# EAGLE design 1_Main (EAGLE 7.6.0)
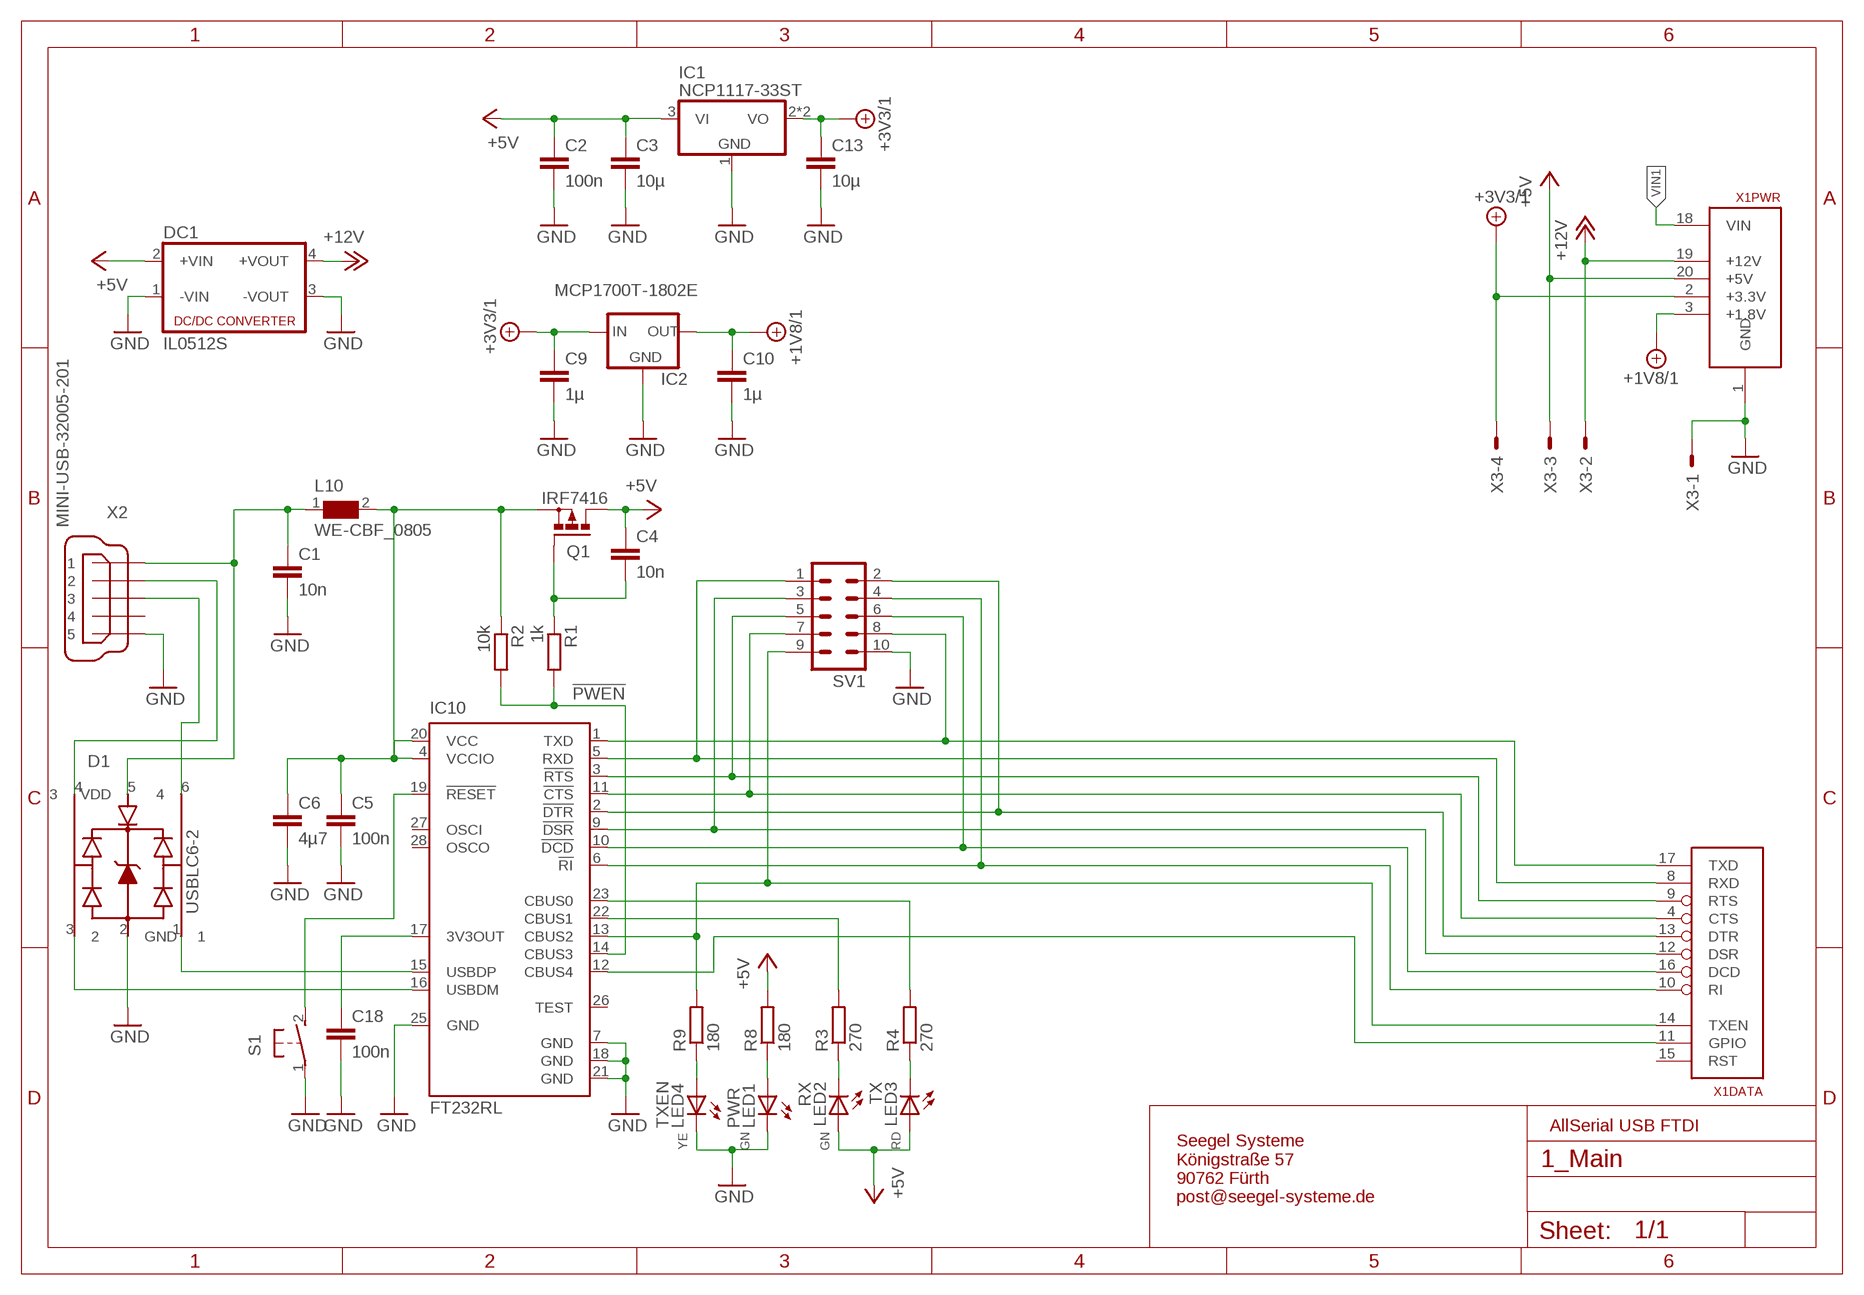
[diagram p0: schematic, sheet 1]

## Parts
C1  10n  C-EUC0805  [C0805]
C2  100n  C-EUC0805  [C0805]
C3  10µ  C-EUC0805  [C0805]
C4  10n  C-EUC0805  [C0805]
C5  100n  C-EUC0805  [C0805]
C6  4µ7  C-EUC0805  [C0805]
C9  1µ  C-EUC0805  [C0805]
C10  1µ  C-EUC0805  [C0805]
C13  10µ  C-EUC0805  [C0805]
C18  100n  C-EUC0805  [C0805]
D1  USBLC6-2  WE-TVS_82400102  [WE-TVS_SOT23-6L]
DC1  IL0512S  NME  [NME]
IC1  NCP1117-33ST  [SOT223]
IC2  MCP1700T-1802E  MCP170X  [SOT23]
IC10  FT232RL  [SSOP28]
L10  WE-CBF_0805  [0805]
LED1  PWR  LEDCHIPLED_0603  [CHIPLED_0603]
LED2  RX  LEDCHIPLED_0603  [CHIPLED_0603]
LED3  TX  LEDCHIPLED_0603  [CHIPLED_0603]
LED4  TXEN  LEDCHIPLED_0603  [CHIPLED_0603]
Q1  IRF7416  P-MOSFET-SO8  [SO-08]
R1  1k  R-EU_R0805  [R0805]
R2  10k  R-EU_R0805  [R0805]
R3  270  R-EU_R0805  [R0805]
R4  270  R-EU_R0805  [R0805]
R8  180  R-EU_R0805  [R0805]
R9  180  R-EU_R0805  [R0805]
S1  31-XX  [B3F-31XX]
SV1  ML10  [ML10]
X1  ALLSERIALMASTERMM  [MAIN-THT]
X2  MINI-USB-32005-201  [32005-201]
X3  AKL18X-04W  [AKL182-04]

## Nets
!PWEN: IC10.14(CBUS3) R1.2 R2.2
+1V8/1: C10.1 IC2.2(OUT) X1.3(PWR:+1.8V)
+3V3/1: C9.1 C13.1 IC1.2(VO) IC1.4(VO) IC2.3(IN) X1.2(PWR:+3.3V) X3.P$4
+5V: C2.1 C3.1 C4.1 DC1.2(+VIN) IC1.3(VI) LED2.A LED3.A Q1.5(D) Q1.6(D) Q1.7(D) Q1.8(D) R8.2 X1.20(PWR:+5V) X3.P$3
+12V: DC1.4(+VOUT) X1.19(PWR:+12V) X3.P$2
GND: C1.2 C2.2 C3.2 C5.2 C6.2 C9.2 C10.2 C13.2 C18.2 D1.2(GND) DC1.1(-VIN) DC1.3(-VOUT) IC1.1(GND) IC2.1(GND) IC10.7(GND) IC10.18(GND) IC10.21(GND) IC10.25(GND) LED1.C LED4.C S1.1(P) SV1.10 X1.1(PWR:GND) X2.5 X3.P$1
N$1: IC10.5(RXD) SV1.1 X1.8(DATA:RXD)
N$2: IC10.9(!DSR) SV1.3 X1.12(DATA:DSR)
N$3: IC10.13(CBUS2) R9.2 SV1.9 X1.14(DATA:TXEN)
N$4: LED3.C R4.1
N$5: IC10.19(!RESET) S1.2(S)
N$6: LED2.C R3.1
N$7: LED4.A R9.1
N$8: LED1.A R8.1
N$9: D1.3 IC10.16(USBDM)
N$10: D1.1 IC10.15(USBDP)
N$11: C1.1 D1.5(VDD) L10.1 X2.1
N$12: D1.4 X2.2
N$13: IC10.12(CBUS4) X1.11(DATA:GPIO)
N$14: IC10.1(TXD) SV1.8 X1.17(DATA:TXD)
N$15: D1.6 X2.3
N$22: C18.1 IC10.17(3V3OUT)
N$29: IC10.3(!RTS) SV1.5 X1.9(DATA:RTS)
N$32: IC10.11(!CTS) SV1.7 X1.4(DATA:CTS)
N$33: IC10.2(!DTR) SV1.2 X1.13(DATA:DTR)
N$35: IC10.10(!DCD) SV1.6 X1.16(DATA:DCD)
N$36: IC10.6(!RI) SV1.4 X1.10(DATA:RI)
N$38: C5.1 C6.1 IC10.4(VCCIO) IC10.20(VCC) L10.2 Q1.1(S) Q1.2(S) Q1.3(S) R2.1
N$42: C4.2 Q1.4(G) R1.1
RXLED: IC10.22(CBUS1) R3.2
TXLED: IC10.23(CBUS0) R4.2
VIN1: X1.18(PWR:VIN)
Unconnected: IC10.26(TEST) IC10.27(OSCI) IC10.28(OSCO) X1.5(USB:D-) X1.6(USB:D+) X1.7(USB:VUSB) X1.15(DATA:RST) X2.4

## Notes on the sheet
- AllSerial USB FTDI
- Seegel Systeme
  Königstraße 57
  90762 Fürth
  post@seegel-systeme.de

## Library data of the parts
C1-C6 C9 C10 C13 C18 = rcl:C-EU: CAPACITOR, European symbol
D1 = EagleLibrary_Wuerth_Elektronik_eiSos_Version_6-9:WE-TVS_82400102: TVS Diode Array WE-TVS, High Speed Series - Low capazity - No leakage current - Low clamping voltage - high ESD voltage protection -- USB 1.0 - 2.0 Flow Thru Design
DC1 = dc-dc-converter:NME: DC-DC CONVERTER; MF: C & D TECHNOLOGIES, INC; MPN: NME1205D; OC_FARNELL: 1021466; OC_NEWARK: 98B8198
IC1 = linear:NCP1117
IC2 = SeeSys:MCP170X
IC10 = ftdichip:FT232R: Source: http://www.ftdichip.com/Documents/DataSheets/DS_FT232R_v104.pdf; MPN: FT232RL; OC_FARNELL: 1146032; OC_NEWARK: 91K9918
L10 = EagleLibrary_Wuerth_Elektronik_eiSos_Version_6-12:WE-CBF: SMD EMI Suppression Ferrite Beads WE-CBF - Excellent anti-EMI properties - Low DC-restistance - Impedances till 3000 ohms - Rated current up to 6 A -- Reliable Ni-Sn electrodes -- Perfect as data lined filter and for uncoupling of distribution voltage
LED1 LED2 = led:LED: LED OSRAM: - CHIPLED LG R971, LG N971, LY N971, LG Q971, LY Q971, LO R971, LY R971 LH N974, LH R974 LS Q976, LO Q976, LY Q976 LO Q996 - Hyper CHIPLED LW Q18S LB Q993, LB Q99A, LB R99A - SideLED LS A670, LO A670, LY A670, LG A670, LP A670 LB A673, LV A673, LT A673, LW A673 LH A674 LY A675 LS A676, LA A676, LO A676, LY A676, LW A676 LS A679, LY A679, LG A679 - Hyper Micro SIDELED® LS Y876, LA Y876, LO Y876, LY Y876 LT Y87S - SmartLED LW L88C, LW L88S LB L89C, LB L89S, LG L890 LS L89K, LO L89K, LY L89K LS L896, LA L896, LO L896, LY L896 - TOPLED LS T670, LO T670, LY T670, LG T670, LP T670 LSG T670, LSP T670, LSY T670, LOP T670, LYG T670 LG T671, LOG T671, LSG T671 LB T673, LV T673, LT T673, LW T673 LH T674 LS T676, LA T676, LO T676, LY T676, LB T676, LH T676, LSB T676, LW T676 LB T67C, LV T67C, LT T67C, LS T67K, LO T67K, LY T67K, LW E67C LS E67B, LA E67B, LO E67B, LY E67B, LB E67C, LV E67C, LT E67C LW T67C LS T679, LY T679, LG T679 LS T770, LO T770, LY T770, LG T770, LP T770 LB T773, LV T773, LT T773, LW T773 LH T774 LS E675, LA E675, LY E675, LS T675 LS T776, LA T776, LO T776, LY T776, LB T776 LHGB T686 LT T68C, LB T68C - Hyper Mini TOPLED® LB M676 - Mini TOPLED Santana® LG M470 LS M47K, LO M47K, LY M47K Source: http://www.osram.convergy.de LUXEON: - LUMILED® LXK2-PW12-R00, LXK2-PW12-S00, LXK2-PW14-U00, LXK2-PW14-V00 LXK2-PM12-R00, LXK2-PM12-S00, LXK2-PM14-U00 LXK2-PE12-Q00, LXK2-PE12-R00, LXK2-PE12-S00, LXK2-PE14-T00, LXK2-PE14-U00 LXK2-PB12-K00, LXK2-PB12-L00, LXK2-PB12-M00, LXK2-PB14-N00, LXK2-PB14-P00, LXK2-PB14-Q00 LXK2-PR12-L00, LXK2-PR12-M00, LXK2-PR14-Q00, LXK2-PR14-R00 LXK2-PD12-Q00, LXK2-PD12-R00, LXK2-PD12-S00 LXK2-PH12-R00, LXK2-PH12-S00 LXK2-PL12-P00, LXK2-PL12-Q00, LXK2-PL12-R00 Source: www.luxeon.com KINGBRIGHT: KA-3528ASYC Source: www.kingbright.com; COLOR: GN
LED3 = led:LED: LED OSRAM: - CHIPLED LG R971, LG N971, LY N971, LG Q971, LY Q971, LO R971, LY R971 LH N974, LH R974 LS Q976, LO Q976, LY Q976 LO Q996 - Hyper CHIPLED LW Q18S LB Q993, LB Q99A, LB R99A - SideLED LS A670, LO A670, LY A670, LG A670, LP A670 LB A673, LV A673, LT A673, LW A673 LH A674 LY A675 LS A676, LA A676, LO A676, LY A676, LW A676 LS A679, LY A679, LG A679 - Hyper Micro SIDELED® LS Y876, LA Y876, LO Y876, LY Y876 LT Y87S - SmartLED LW L88C, LW L88S LB L89C, LB L89S, LG L890 LS L89K, LO L89K, LY L89K LS L896, LA L896, LO L896, LY L896 - TOPLED LS T670, LO T670, LY T670, LG T670, LP T670 LSG T670, LSP T670, LSY T670, LOP T670, LYG T670 LG T671, LOG T671, LSG T671 LB T673, LV T673, LT T673, LW T673 LH T674 LS T676, LA T676, LO T676, LY T676, LB T676, LH T676, LSB T676, LW T676 LB T67C, LV T67C, LT T67C, LS T67K, LO T67K, LY T67K, LW E67C LS E67B, LA E67B, LO E67B, LY E67B, LB E67C, LV E67C, LT E67C LW T67C LS T679, LY T679, LG T679 LS T770, LO T770, LY T770, LG T770, LP T770 LB T773, LV T773, LT T773, LW T773 LH T774 LS E675, LA E675, LY E675, LS T675 LS T776, LA T776, LO T776, LY T776, LB T776 LHGB T686 LT T68C, LB T68C - Hyper Mini TOPLED® LB M676 - Mini TOPLED Santana® LG M470 LS M47K, LO M47K, LY M47K Source: http://www.osram.convergy.de LUXEON: - LUMILED® LXK2-PW12-R00, LXK2-PW12-S00, LXK2-PW14-U00, LXK2-PW14-V00 LXK2-PM12-R00, LXK2-PM12-S00, LXK2-PM14-U00 LXK2-PE12-Q00, LXK2-PE12-R00, LXK2-PE12-S00, LXK2-PE14-T00, LXK2-PE14-U00 LXK2-PB12-K00, LXK2-PB12-L00, LXK2-PB12-M00, LXK2-PB14-N00, LXK2-PB14-P00, LXK2-PB14-Q00 LXK2-PR12-L00, LXK2-PR12-M00, LXK2-PR14-Q00, LXK2-PR14-R00 LXK2-PD12-Q00, LXK2-PD12-R00, LXK2-PD12-S00 LXK2-PH12-R00, LXK2-PH12-S00 LXK2-PL12-P00, LXK2-PL12-Q00, LXK2-PL12-R00 Source: www.luxeon.com KINGBRIGHT: KA-3528ASYC Source: www.kingbright.com; COLOR: RD
LED4 = led:LED: LED OSRAM: - CHIPLED LG R971, LG N971, LY N971, LG Q971, LY Q971, LO R971, LY R971 LH N974, LH R974 LS Q976, LO Q976, LY Q976 LO Q996 - Hyper CHIPLED LW Q18S LB Q993, LB Q99A, LB R99A - SideLED LS A670, LO A670, LY A670, LG A670, LP A670 LB A673, LV A673, LT A673, LW A673 LH A674 LY A675 LS A676, LA A676, LO A676, LY A676, LW A676 LS A679, LY A679, LG A679 - Hyper Micro SIDELED® LS Y876, LA Y876, LO Y876, LY Y876 LT Y87S - SmartLED LW L88C, LW L88S LB L89C, LB L89S, LG L890 LS L89K, LO L89K, LY L89K LS L896, LA L896, LO L896, LY L896 - TOPLED LS T670, LO T670, LY T670, LG T670, LP T670 LSG T670, LSP T670, LSY T670, LOP T670, LYG T670 LG T671, LOG T671, LSG T671 LB T673, LV T673, LT T673, LW T673 LH T674 LS T676, LA T676, LO T676, LY T676, LB T676, LH T676, LSB T676, LW T676 LB T67C, LV T67C, LT T67C, LS T67K, LO T67K, LY T67K, LW E67C LS E67B, LA E67B, LO E67B, LY E67B, LB E67C, LV E67C, LT E67C LW T67C LS T679, LY T679, LG T679 LS T770, LO T770, LY T770, LG T770, LP T770 LB T773, LV T773, LT T773, LW T773 LH T774 LS E675, LA E675, LY E675, LS T675 LS T776, LA T776, LO T776, LY T776, LB T776 LHGB T686 LT T68C, LB T68C - Hyper Mini TOPLED® LB M676 - Mini TOPLED Santana® LG M470 LS M47K, LO M47K, LY M47K Source: http://www.osram.convergy.de LUXEON: - LUMILED® LXK2-PW12-R00, LXK2-PW12-S00, LXK2-PW14-U00, LXK2-PW14-V00 LXK2-PM12-R00, LXK2-PM12-S00, LXK2-PM14-U00 LXK2-PE12-Q00, LXK2-PE12-R00, LXK2-PE12-S00, LXK2-PE14-T00, LXK2-PE14-U00 LXK2-PB12-K00, LXK2-PB12-L00, LXK2-PB12-M00, LXK2-PB14-N00, LXK2-PB14-P00, LXK2-PB14-Q00 LXK2-PR12-L00, LXK2-PR12-M00, LXK2-PR14-Q00, LXK2-PR14-R00 LXK2-PD12-Q00, LXK2-PD12-R00, LXK2-PD12-S00 LXK2-PH12-R00, LXK2-PH12-S00 LXK2-PL12-P00, LXK2-PL12-Q00, LXK2-PL12-R00 Source: www.luxeon.com KINGBRIGHT: KA-3528ASYC Source: www.kingbright.com; COLOR: YE
Q1 = transistor-power:P-MOSFET-SO8: P-Channel MOSFET Example: FDS4435A; P-Channel Logic Level PowerTrench® MOSFET FDS4465; P-Channel 1.8V Specified PowerTrench® MOSFET Source: www.fairchildsemi.com
R1-R4 R8 R9 = rcl:R-EU_: RESISTOR, European symbol
S1 = switch-omron:31-XX: OMRON SWITCH; MPN: B3F-3100; OC_FARNELL: 959704; OC_NEWARK: 36M3582
SV1 = con-harting-ml:ML10: HARTING; OC_FARNELL: unknown; OC_NEWARK: unknown
X1 = AllSerialv2:ALLSERIALMASTER
X2 = con-cypressindustries:MINI-USB-: MINI USB-B Conector Source: www.cypressindustries.com; OC_FARNELL: unknown; OC_NEWARK: unknown
X3 = con-riacon_akl:AKL18X-04: Riacon AKL18X Steckverbinder 4-Pol Grid = 3,5mm

## Board
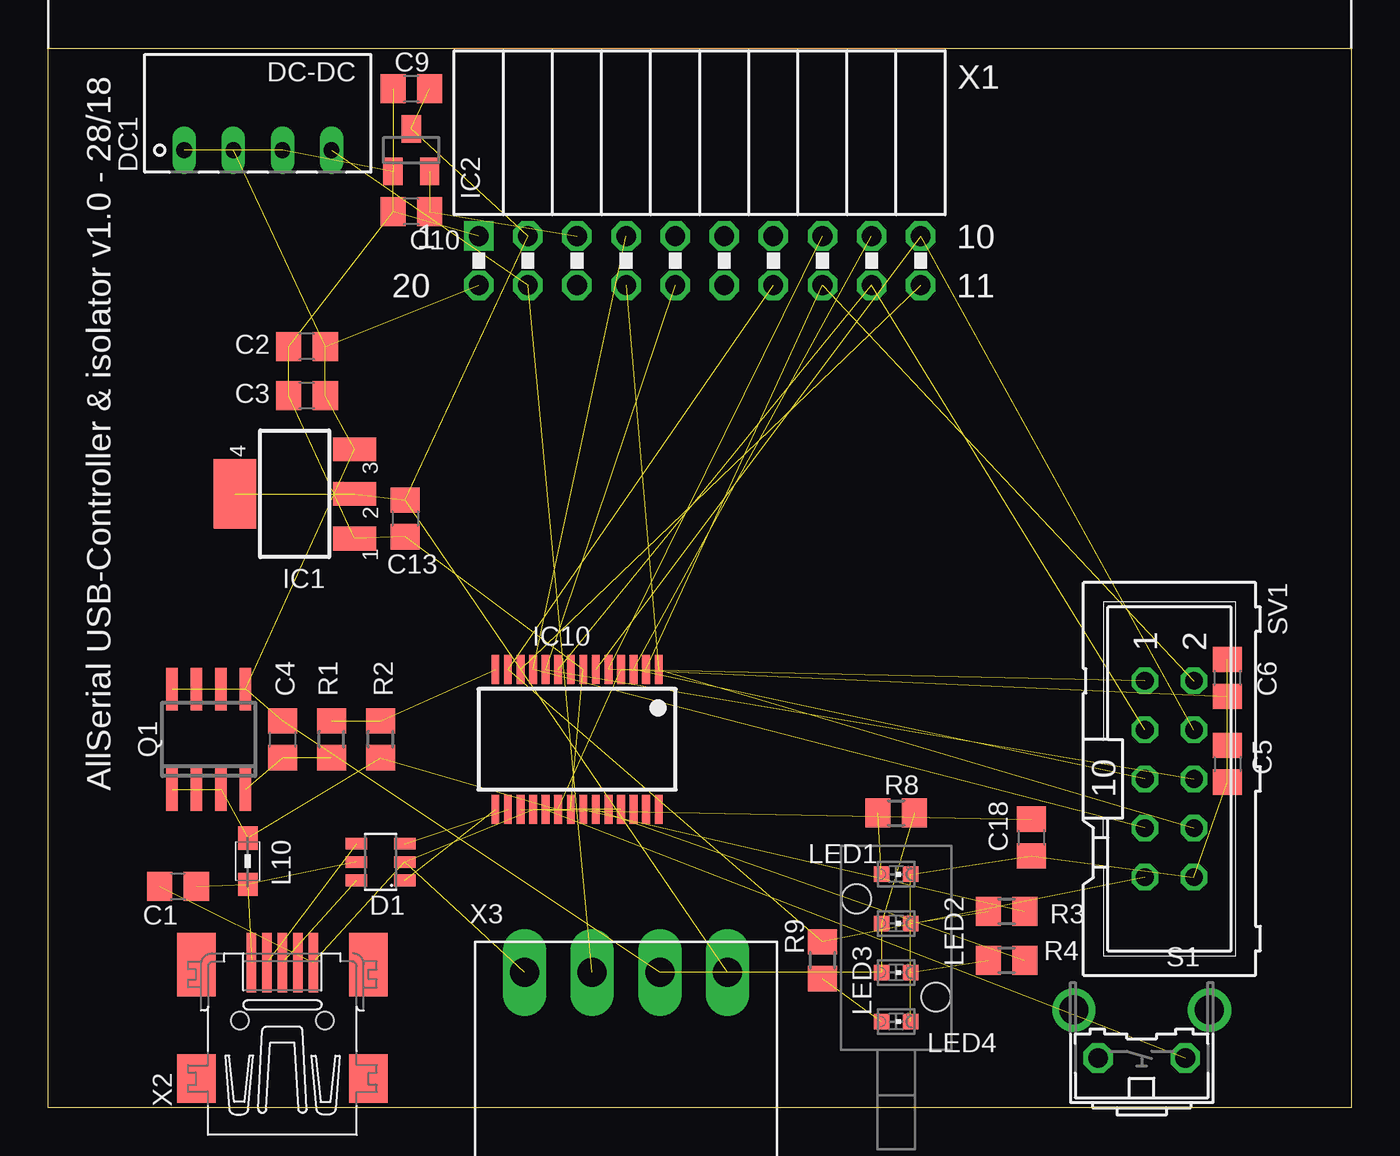
[diagram p1: board, top side]
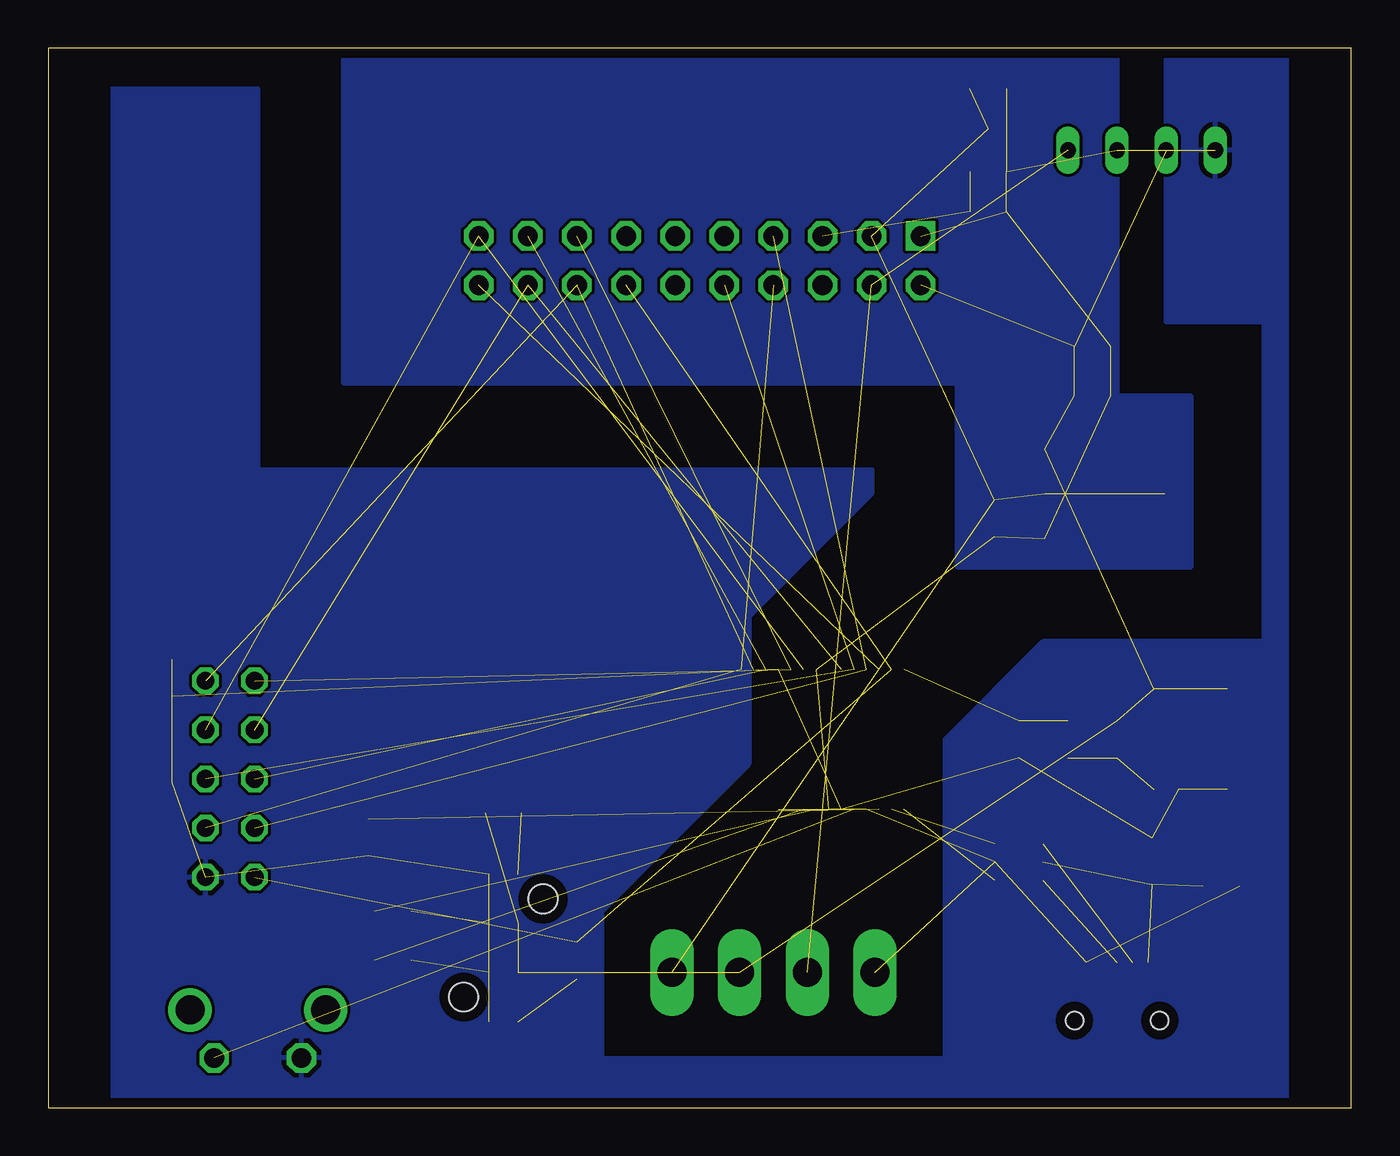
[diagram p2: board, bottom side, seen from below]

Size 67.4 x 54.8 mm. Coordinates in mm from the lower left corner, seen from the top.
Copper layers (1*16): Top 0.035mm / dielectric 1.6mm / Bottom 0.035mm
Design rules "Elecrow_2-layer_PCB_eagle_rule *": minimum track width 6mil, minimum drill 0.3mm, track to track 6mil, track to pad 6mil, pad to pad 6mil, via to via 8mil, smd to smd 0mil, copper to edge 20mil, drill to drill 10mil, minimum pad ring 6mil, minimum via ring 6mil, stop-mask expansion 0mil, vias tented up to drill 100mil, thermal gap 10mil

### Footprints (pad centres in the part's own frame; a part is rotated, then mirrored left to right if it is on the bottom)
C0805 = smd 1.3 x 1.5: 1 -0.95,0; 2 0.95,0
WE-TVS_SOT23-6L = smd 0.6 x 1.1: 1 -0.95,-1.25; 2 0,-1.25; 3 0.95,-1.25; 4 0.95,1.25; 5 0,1.25; 6 -0.95,1.25
NME = drill 0.813 long: 1 0,3.81; 2 0,1.27; 3 0,-1.27; 4 0,-3.81
SOT223 = smd 1.219 x 2.235: 1 -2.311,-3.099; 2 0,-3.099; 3 2.311,-3.099 | smd 3.6 x 2.2: 4 0,3.099
SOT23 = smd 1 x 1.4: 1 -0.95,-1.1; 2 0.95,-1.1; 3 0,1.1
SSOP28 = smd 0.4 x 1.5: 1 -4.225,-3.625; 2 -3.575,-3.625; 3 -2.925,-3.625; 4 -2.275,-3.625; 5 -1.625,-3.625; 6 -0.975,-3.625; 7 -0.325,-3.625; 8 0.325,-3.625; 9 0.975,-3.625; 10 1.625,-3.625; 11 2.275,-3.625; 12 2.925,-3.625; 13 3.575,-3.625; 14 4.225,-3.625; 15 4.225,3.625; 16 3.575,3.625; 17 2.925,3.625; 18 2.275,3.625; 19 1.625,3.625; 20 0.975,3.625; 21 0.325,3.625; 22 -0.325,3.625; 23 -0.975,3.625; 24 -1.625,3.625; 25 -2.275,3.625; 26 -2.925,3.625; 27 -3.575,3.625; 28 -4.225,3.625
0805 = smd 1.2 x 1: 1 -1.2,0; 2 1.2,0
CHIPLED_0603 = smd 0.8 x 0.8: A 0,-0.75; C 0,0.75
SO-08 = smd 0.6 x 2.2: 1 -1.905,-2.6; 2 -0.635,-2.6; 3 0.635,-2.6; 4 1.905,-2.6; 5 1.905,2.6; 6 0.635,2.6; 7 -0.635,2.6; 8 -1.905,2.6
R0805 = smd 1.3 x 1.5: 1 -0.95,0; 2 0.95,0
B3F-31XX = drill 1.016 octagon: 1 -2.261,-1.245; 2 2.261,-1.245 | drill 1.499 pad 2.159: 3 -3.505,1.245; 4 3.505,1.245
ML10 = drill 0.914 octagon: 1 -5.08,-1.27; 2 -5.08,1.27; 3 -2.54,-1.27; 4 -2.54,1.27; 5 0,-1.27; 6 0,1.27; 7 2.54,-1.27; 8 2.54,1.27; 9 5.08,-1.27; 10 5.08,1.27
1296.1004 = hole 1.5: 2.05,-2.54; -2.05,2.54
MAIN-THT = drill 1.016 square: 1 -11.43,45.085 | drill 1.016 octagon: 2 -8.89,45.085; 3 -6.35,45.085; 4 -3.81,45.085; 5 -1.27,45.085; 6 1.27,45.085; 7 3.81,45.085; 8 6.35,45.085; 9 8.89,45.085; 10 11.43,45.085; 11 11.43,42.545; 12 8.89,42.545; 13 6.35,42.545; 14 3.81,42.545; 15 1.27,42.545; 16 -1.27,42.545; 17 -3.81,42.545; 18 -6.35,42.545; 19 -8.89,42.545; 20 -11.43,42.545
32005-201 = smd 3.1 x 0.5: 1 3,1.6; 2 3,0.8; 3 3,0; 4 3,-0.8; 5 3,-1.6 | smd 2.5 x 2: M1 -3,-4.45; M2 -3,4.45 | smd 3.3 x 2: M3 2.9,4.45; M4 2.9,-4.45 | hole 0.9: 0,2.2; 0,-2.2
AKL182-04 = drill 1.5 pad 2.184 long: P$1 -5.25,0; P$2 -1.75,0; P$3 1.75,0; P$4 5.25,0

### Placement (x,y rotation side)
C1  6.71,11.43 180 top
C2  13.38,39.37 180 top
C3  13.38,36.83 180 top
C4  12.11,19.05 270 top
C5  61.01,17.78 270 top
C6  61.01,22.23 90 top
C9  18.78,52.7 180 top
C10  18.78,46.35 180 top
C13  18.46,30.48 270 top
C18  50.84,13.97 270 top
D1  17.19,12.7 90 top
DC1  10.84,49.53 90 top
IC1  12.75,31.75 90 top
IC2  18.78,49.53 0 top
IC10  27.35,19.05 180 top
L10  10.32,12.74 90 top
LED1  43.86,12.06 270 top
LED2  43.86,9.53 270 top
LED3  43.86,6.99 270 top
LED4  43.86,4.45 270 top
Q1  8.3,19.05 0 top
R1  14.65,19.05 90 top
R2  17.19,19.05 90 top
R3  49.58,10.16 0 top
R4  49.58,7.62 0 top
R8  43.86,15.24 0 top
R9  40.05,7.62 90 top
S1  56.56,3.81 0 top
SV1  58,17 270 top
U$3  [1296.1004]  43.86,8.26 180 top
X1  33.7,0 0 top
X2  12.11,4.5 90 top
X3  29.89,6.99 0 top

### Tracks (layer width: path | path; a pad name or v marks a point on that pad's centre or on a via)
!PWEN  (2 unrouted)
+1V8/1  (2 unrouted)
+3V3/1  (6 unrouted)
+5V  (13 unrouted)
+12V  (2 unrouted)
GND  (22 unrouted)
  pour Bottom: -0.59,0 68.55,0 68.31,52.7 56.56,52.7 56.56,33.02 24.81,33.02 24.81,31.75 31.16,25.4 31.16,17.78 38.78,10.16 38.78,2.54 21,2.54 21,19.05 15.92,24.13 4.49,24.13 4.49,40.64 9.57,40.64 9.57,54.95 -0.59,54.95
GND1
  pour Bottom: 12.11,54.61 12.11,36.83 8.3,36.83 8.3,27.94 20.37,27.94 20.37,37.47 52.12,37.47 52.12,54.61
N$1  (2 unrouted)
N$2  (2 unrouted)
N$3  (3 unrouted)
N$4  (1 unrouted)
N$5  (1 unrouted)
N$6  (1 unrouted)
N$7  (1 unrouted)
N$8  (1 unrouted)
N$9  (1 unrouted)
N$10  (1 unrouted)
N$11  (3 unrouted)
N$12  (1 unrouted)
N$13  (1 unrouted)
N$14  (2 unrouted)
N$15  (1 unrouted)
N$22  (1 unrouted)
N$29  (2 unrouted)
N$32  (2 unrouted)
N$33  (2 unrouted)
N$35  (2 unrouted)
N$36  (2 unrouted)
N$38  (8 unrouted)
N$42  (2 unrouted)
RXLED  (1 unrouted)
TXLED  (1 unrouted)

### Text on the board
tPlace: AllSerial USB-Controller & isolator v1.0 - 28/18